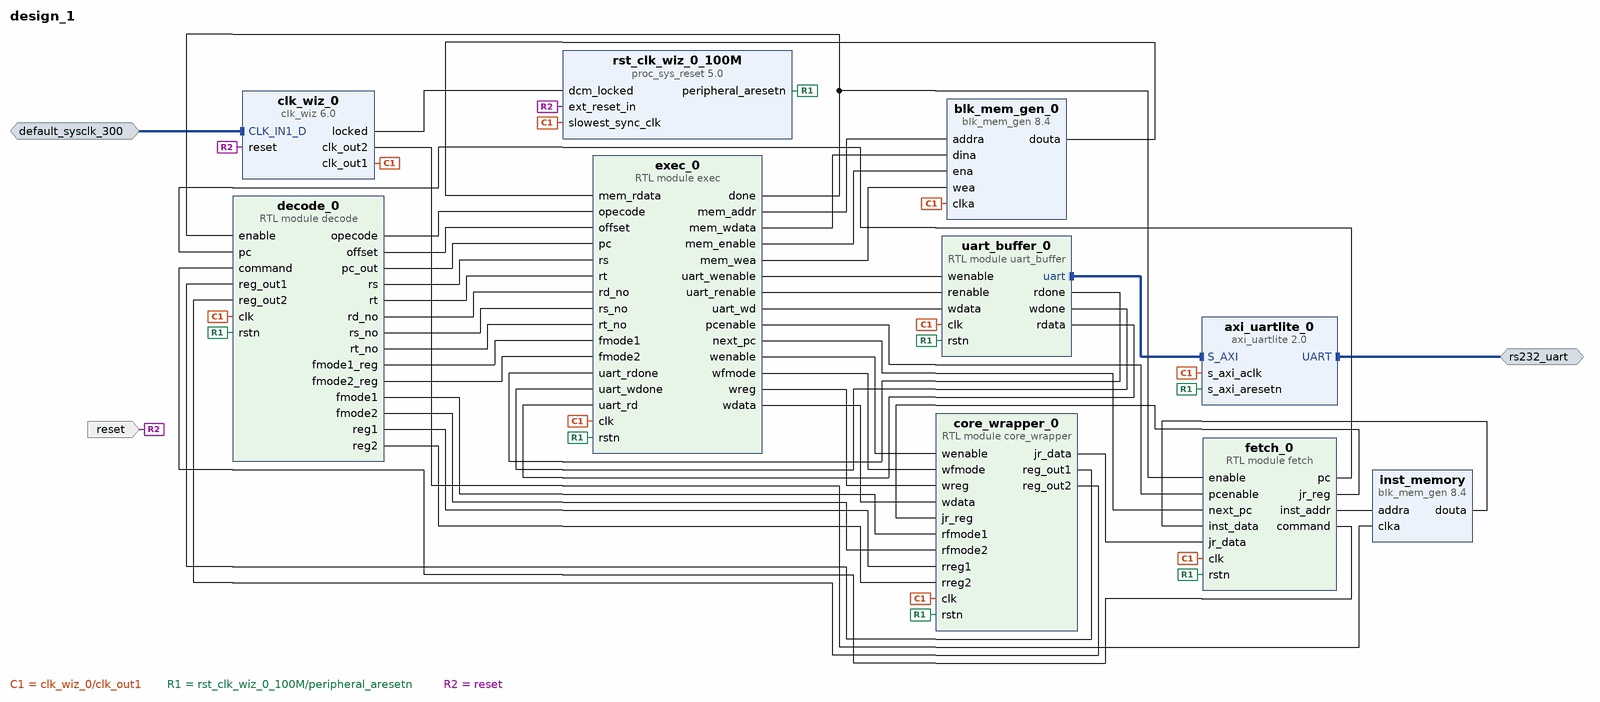
[diagram p0: block diagram of the top level]
# Vivado block design design_1, xcku040-ffva1156-2-e, Vivado 2019.2
create_bd_design design_1

create_bd_intf_port -mode Master -vlnv xilinx.com:interface:uart_rtl:1.0 rs232_uart
create_bd_intf_port -mode Slave -vlnv xilinx.com:interface:diff_clock_rtl:1.0 default_sysclk_300
set_property -dict {CONFIG.FREQ_HZ 300000000} [get_bd_intf_ports default_sysclk_300]
create_bd_port -dir I -type rst reset
set_property -dict {CONFIG.POLARITY ACTIVE_HIGH} [get_bd_ports reset]

create_bd_cell -type module -reference core_wrapper core_wrapper_0
create_bd_cell -type ip -vlnv xilinx.com:ip:axi_uartlite:2.0 axi_uartlite_0
set_property -dict [list \
  CONFIG.C_BAUDRATE 115200 \
  CONFIG.C_S_AXI_ACLK_FREQ_HZ 50000000 \
  CONFIG.C_S_AXI_ACLK_FREQ_HZ_d 50.0 \
  CONFIG.UARTLITE_BOARD_INTERFACE rs232_uart \
  CONFIG.USE_BOARD_FLOW true \
] [get_bd_cells axi_uartlite_0]
create_bd_cell -type ip -vlnv xilinx.com:ip:clk_wiz:6.0 clk_wiz_0
set_property -dict [list \
  CONFIG.CLKOUT1_JITTER 148.677 \
  CONFIG.CLKOUT1_REQUESTED_OUT_FREQ 50.000 \
  CONFIG.CLKOUT2_JITTER 129.666 \
  CONFIG.CLKOUT2_PHASE_ERROR 98.575 \
  CONFIG.CLKOUT2_REQUESTED_OUT_FREQ 100.000 \
  CONFIG.CLKOUT2_USED true \
  CONFIG.CLK_IN1_BOARD_INTERFACE default_sysclk_300 \
  CONFIG.MMCM_CLKOUT0_DIVIDE_F 20.000 \
  CONFIG.MMCM_CLKOUT1_DIVIDE 10 \
  CONFIG.NUM_OUT_CLKS 2 \
  CONFIG.RESET_BOARD_INTERFACE reset \
  CONFIG.USE_BOARD_FLOW true \
] [get_bd_cells clk_wiz_0]
create_bd_cell -type ip -vlnv xilinx.com:ip:proc_sys_reset:5.0 rst_clk_wiz_0_100M
set_property -dict {CONFIG.RESET_BOARD_INTERFACE reset CONFIG.USE_BOARD_FLOW true} [get_bd_cells rst_clk_wiz_0_100M]
create_bd_cell -type ip -vlnv xilinx.com:ip:blk_mem_gen:8.4 inst_memory
set_property -dict [list \
  CONFIG.Coe_File ../../../../../../../inst_memory.coe \
  CONFIG.Enable_32bit_Address false \
  CONFIG.Enable_A Always_Enabled \
  CONFIG.Fill_Remaining_Memory_Locations false \
  CONFIG.Load_Init_File true \
  CONFIG.Memory_Type Single_Port_ROM \
  CONFIG.Port_A_Write_Rate 0 \
  CONFIG.Register_PortA_Output_of_Memory_Primitives false \
  CONFIG.Use_RSTA_Pin false \
  CONFIG.Write_Depth_A 131072 \
  CONFIG.use_bram_block Stand_Alone \
] [get_bd_cells inst_memory]
create_bd_cell -type ip -vlnv xilinx.com:ip:blk_mem_gen:8.4 blk_mem_gen_0
set_property -dict [list \
  CONFIG.Byte_Size 8 \
  CONFIG.Enable_32bit_Address false \
  CONFIG.Read_Width_A 32 \
  CONFIG.Register_PortA_Output_of_Memory_Primitives false \
  CONFIG.Use_Byte_Write_Enable true \
  CONFIG.Use_RSTA_Pin false \
  CONFIG.Write_Depth_A 491520 \
  CONFIG.Write_Width_A 32 \
  CONFIG.use_bram_block Stand_Alone \
] [get_bd_cells blk_mem_gen_0]
create_bd_cell -type module -reference decode decode_0
create_bd_cell -type module -reference fetch fetch_0
create_bd_cell -type module -reference exec exec_0
create_bd_cell -type module -reference uart_buffer uart_buffer_0

# ---- connections ----

connect_bd_intf_net [get_bd_intf_ports rs232_uart] [get_bd_intf_pins axi_uartlite_0/UART]
connect_bd_intf_net [get_bd_intf_pins axi_uartlite_0/S_AXI] [get_bd_intf_pins uart_buffer_0/uart]
connect_bd_intf_net -intf_net default_sysclk_300_1 [get_bd_intf_ports default_sysclk_300] [get_bd_intf_pins clk_wiz_0/CLK_IN1_D]
connect_bd_net [get_bd_pins fetch_0/pc] [get_bd_pins decode_0/pc]
connect_bd_net [get_bd_pins fetch_0/command] [get_bd_pins decode_0/command]
connect_bd_net [get_bd_pins exec_0/done] [get_bd_pins decode_0/enable] [get_bd_pins fetch_0/enable]
connect_bd_net [get_bd_pins core_wrapper_0/reg_out1] [get_bd_pins decode_0/reg_out1]
connect_bd_net [get_bd_pins core_wrapper_0/reg_out2] [get_bd_pins decode_0/reg_out2]
connect_bd_net [get_bd_pins core_wrapper_0/jr_data] [get_bd_pins fetch_0/jr_data]
connect_bd_net [get_bd_pins fetch_0/jr_reg] [get_bd_pins core_wrapper_0/jr_reg]
connect_bd_net [get_bd_pins decode_0/opecode] [get_bd_pins exec_0/opecode]
connect_bd_net [get_bd_pins decode_0/offset] [get_bd_pins exec_0/offset]
connect_bd_net [get_bd_pins decode_0/pc_out] [get_bd_pins exec_0/pc]
connect_bd_net [get_bd_pins decode_0/rs] [get_bd_pins exec_0/rs]
connect_bd_net [get_bd_pins decode_0/rt] [get_bd_pins exec_0/rt]
connect_bd_net [get_bd_pins decode_0/rd_no] [get_bd_pins exec_0/rd_no]
connect_bd_net [get_bd_pins decode_0/rs_no] [get_bd_pins exec_0/rs_no]
connect_bd_net [get_bd_pins decode_0/rt_no] [get_bd_pins exec_0/rt_no]
connect_bd_net [get_bd_pins decode_0/fmode1_reg] [get_bd_pins exec_0/fmode1]
connect_bd_net [get_bd_pins decode_0/fmode2_reg] [get_bd_pins exec_0/fmode2]
connect_bd_net [get_bd_pins decode_0/fmode1] [get_bd_pins core_wrapper_0/rfmode1]
connect_bd_net [get_bd_pins decode_0/fmode2] [get_bd_pins core_wrapper_0/rfmode2]
connect_bd_net [get_bd_pins decode_0/reg1] [get_bd_pins core_wrapper_0/rreg1]
connect_bd_net [get_bd_pins decode_0/reg2] [get_bd_pins core_wrapper_0/rreg2]
connect_bd_net [get_bd_pins exec_0/wenable] [get_bd_pins core_wrapper_0/wenable]
connect_bd_net [get_bd_pins exec_0/wfmode] [get_bd_pins core_wrapper_0/wfmode]
connect_bd_net [get_bd_pins exec_0/wreg] [get_bd_pins core_wrapper_0/wreg]
connect_bd_net [get_bd_pins exec_0/wdata] [get_bd_pins core_wrapper_0/wdata]
connect_bd_net [get_bd_pins exec_0/pcenable] [get_bd_pins fetch_0/pcenable]
connect_bd_net [get_bd_pins exec_0/next_pc] [get_bd_pins fetch_0/next_pc]
connect_bd_net [get_bd_pins exec_0/uart_wenable] [get_bd_pins uart_buffer_0/wenable]
connect_bd_net [get_bd_pins exec_0/uart_renable] [get_bd_pins uart_buffer_0/renable]
connect_bd_net [get_bd_pins exec_0/uart_wd] [get_bd_pins uart_buffer_0/wdata]
connect_bd_net [get_bd_pins uart_buffer_0/rdone] [get_bd_pins exec_0/uart_rdone]
connect_bd_net [get_bd_pins uart_buffer_0/wdone] [get_bd_pins exec_0/uart_wdone]
connect_bd_net [get_bd_pins uart_buffer_0/rdata] [get_bd_pins exec_0/uart_rd]
connect_bd_net [get_bd_pins clk_wiz_0/clk_out1] \
  [get_bd_pins axi_uartlite_0/s_axi_aclk] [get_bd_pins rst_clk_wiz_0_100M/slowest_sync_clk] [get_bd_pins core_wrapper_0/clk] \
  [get_bd_pins blk_mem_gen_0/clka] [get_bd_pins decode_0/clk] [get_bd_pins fetch_0/clk] [get_bd_pins exec_0/clk] \
  [get_bd_pins uart_buffer_0/clk]
connect_bd_net [get_bd_pins clk_wiz_0/locked] [get_bd_pins rst_clk_wiz_0_100M/dcm_locked]
connect_bd_net [get_bd_pins rst_clk_wiz_0_100M/peripheral_aresetn] \
  [get_bd_pins axi_uartlite_0/s_axi_aresetn] [get_bd_pins core_wrapper_0/rstn] [get_bd_pins decode_0/rstn] \
  [get_bd_pins fetch_0/rstn] [get_bd_pins exec_0/rstn] [get_bd_pins uart_buffer_0/rstn]
connect_bd_net [get_bd_ports reset] [get_bd_pins clk_wiz_0/reset] [get_bd_pins rst_clk_wiz_0_100M/ext_reset_in]
connect_bd_net [get_bd_pins fetch_0/inst_addr] [get_bd_pins inst_memory/addra]
connect_bd_net -net blk_mem_gen_0_douta [get_bd_pins inst_memory/douta] [get_bd_pins fetch_0/inst_data]
connect_bd_net [get_bd_pins clk_wiz_0/clk_out2] [get_bd_pins inst_memory/clka]
connect_bd_net [get_bd_pins blk_mem_gen_0/douta] [get_bd_pins exec_0/mem_rdata]
connect_bd_net [get_bd_pins exec_0/mem_addr] [get_bd_pins blk_mem_gen_0/addra]
connect_bd_net [get_bd_pins exec_0/mem_wdata] [get_bd_pins blk_mem_gen_0/dina]
connect_bd_net [get_bd_pins exec_0/mem_enable] [get_bd_pins blk_mem_gen_0/ena]
connect_bd_net [get_bd_pins exec_0/mem_wea] [get_bd_pins blk_mem_gen_0/wea]

# ---- address map ----
assign_bd_address -offset 0x40600000 -range 64K -target_address_space [get_bd_addr_spaces uart_buffer_0/uart] [get_bd_addr_segs axi_uartlite_0/S_AXI/Reg]

validate_bd_design
save_bd_design
